# EasyEDA schematic rs485.json
TITLE: RS485; REV: 1.0; Date: 2022-08-19; Sheet: 1/1
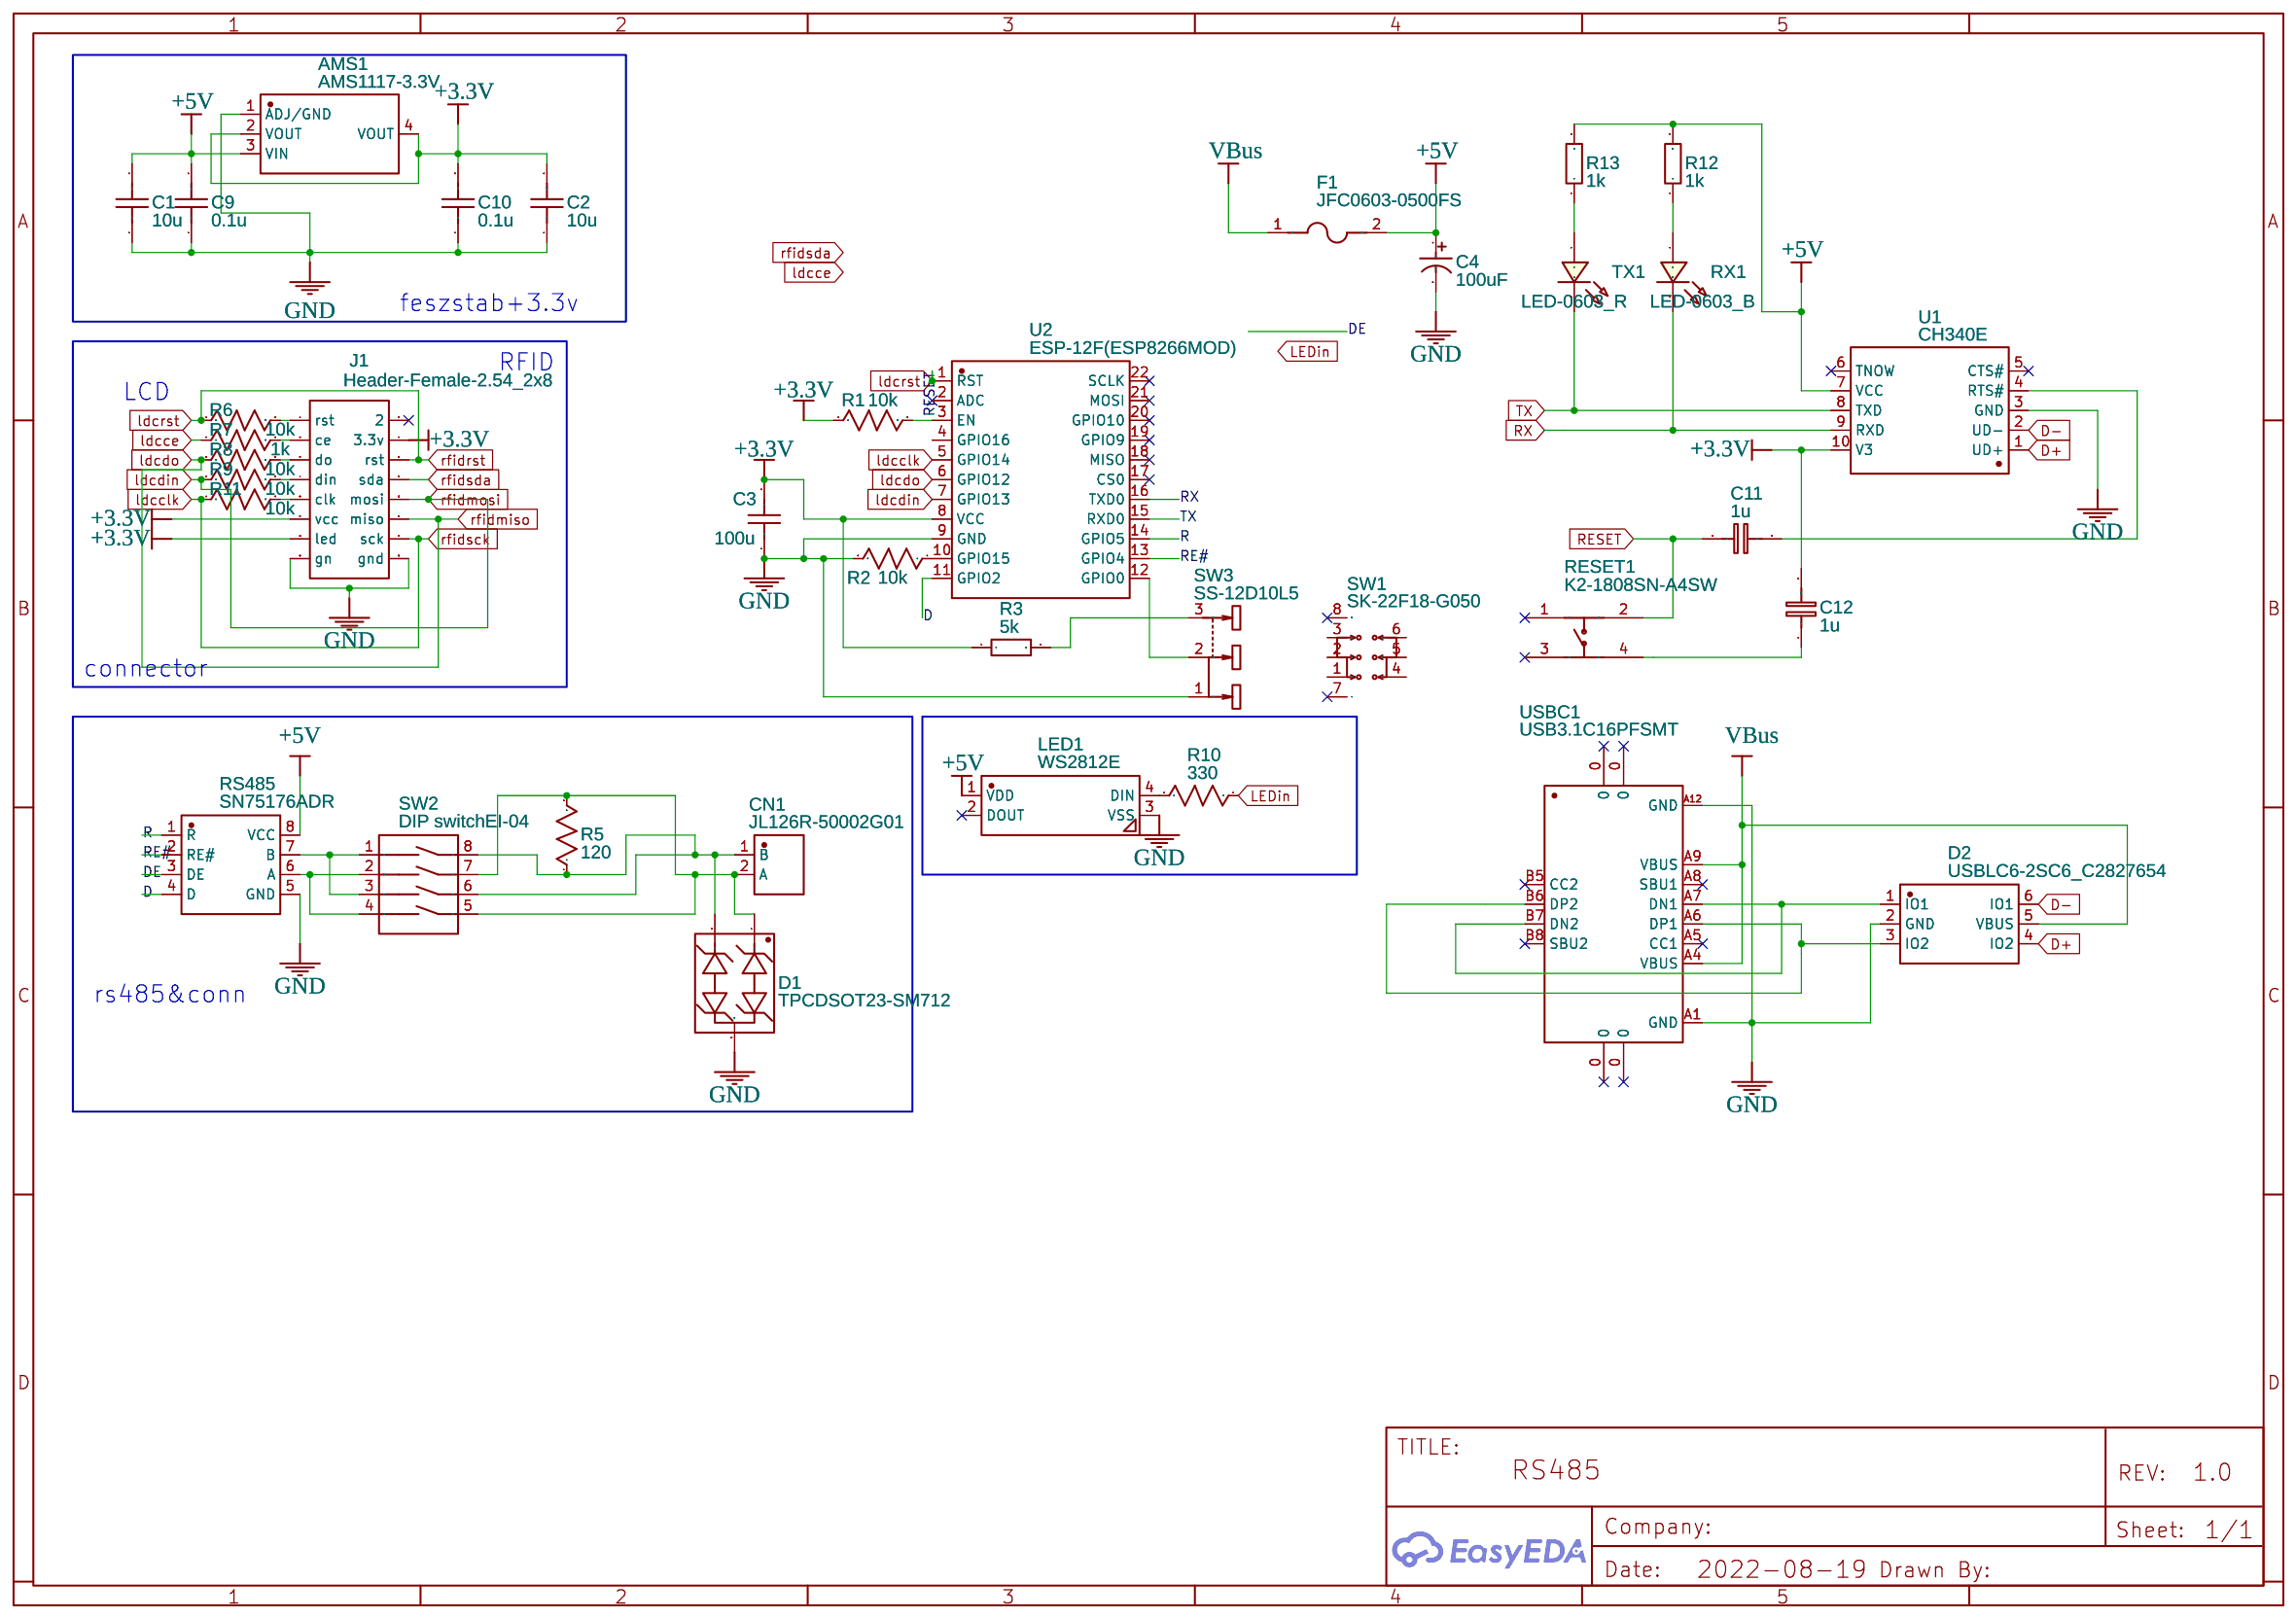
[diagram p0: schematic sheet]

## Parts
AMS1  AMS1117-3.3V  [SOT-223-4_L6.5-W3.5-P2.30-LS7.0-BR]
C1  10u  [C0603]
C2  10u  [C0603]
C3  100u  [C0603]
C4  100uF  [CAP-SMD_BD5.0-L5.3-W5.3-FD]
C9  0.1u  [C0603]
C10  0.1u  [C0603]
C11  1u  [0603]
C12  1u  [0603]
CN1  JL126R-50002G01  [CONN-TH_2P-P5.00_JL126R]
D1  TPCDSOT23-SM712  [SOT-23-3_L2.9-W1.6-P1.90-LS2.8-BR]
D2  USBLC6-2SC6_C2827654  [SOT-23-6_L2.9-W1.6-P0.95-LS2.8-BL]
F1  JFC0603-0500FS  [F0603]
J1  Header-Female-2.54_2x8  [HDR-TH_16P-P2.54-V-F-R2-C8-S2.54-1]
LED1  WS2812E  [LED-SMD_4P-L5.0-W5.0-BR]
R1  10k  [R0603]
R2  10k  [R0603]
R3  5k  [R0603]
R5  120  [R0603]
R6  10k  [R0603]
R7  1k  [R0603]
R8  10k  [R0603]
R9  10k  [R0603]
R10  330  [R0603]
R11  10k  [R0603]
R12  1k  [R0603]
R13  1k  [R0603]
RESET1  K2-1808SN-A4SW  [KEY-SMD_4P-L4.2-W3.2-P2.20-LS5.1-TL]
RS485  SN75176ADR  [SOIC-8_L4.9-W3.9-P1.27-LS6.0-BL]
RX1  LED-0603_B  [LED0603_BLUE]
SW1  SK-22F18-G050  [SW-TH_G-SWITCH_SK-22F18-G050]
SW2  DIP switchEI-04  [SW-TH_DIPSWITCHEI-04]
SW3  SS-12D10L5  [SW-TH_SS-12D10L5]
TX1  LED-0603_R  [LED0603_RED]
U1  CH340E  [MSOP-10_L3.0-W3.0-P0.50-LS5.0-BL]
U2  ESP-12F(ESP8266MOD)  [WIFIM-SMD_ESP-12F-ESP8266MOD]
USBC1  USB3.1C16PFSMT  [USB-C-SMD_TYPE-C-USB-17]

## Library data of the parts
AMS1 = AMS1117-3.3V: Supplier: LCSC; Supplier Part: C2688239; Manufacturer: WPMtek(维攀微); Contributor: LCSC; JLCPCB Part Class: Extended Part
C1-C3 C9 C10 = C_0603_US: Contributor: LCEDA_Lib
C4 = RVT1A101M0505-C3347: Supplier: LCSC; Manufacturer: HONOR; Manufacturer Part: RVT1A101M0505; Supplier Part: C3347
C11 C12 = Cap_0603_EU: Manufacturer Part: ?
CN1 = JL126R-50002G01: Supplier: LCSC; Supplier Part: C415452; Manufacturer: JILN; Contributor: LCSC; JLCPCB Part Class: Extended Part
D1 = TPCDSOT23-SM712: Supplier: LCSC; Supplier Part: C558433; Manufacturer: TECH PUBLIC; Contributor: LCSC; JLCPCB Part Class: Extended Part
D2 = USBLC6-2SC6_C2827654: Supplier: LCSC; Supplier Part: C2827654; Manufacturer: TECH PUBLIC(台舟); Manufacturer Part: USBLC6-2SC6; Contributor: LCSC; JLCPCB Part Class: Extended Part
F1 = JFC0603-0500FS: Supplier: LCSC; Manufacturer: JDTFUSE; Contributor: LCSC; Supplier Part: C136327
J1 = Header-Female-2.54_2x8: Supplier: LCSC; Manufacturer: BOOMELE; Manufacturer Part: 2.54mm,2×8Double female header; Supplier Part: C30734; JLCPCB Part Class: Extended Part
LED1 = WS2812E: Supplier: LCSC; Supplier Part: C139127; Manufacturer: Worldsemi; Contributor: LCSC; JLCPCB Part Class: Extended Part
R1 R2 R5-R11 = R_0603_US: Contributor: LCEDA_Lib
R3 R12 R13 = RS-03K102JT: Supplier: LCSC; Manufacturer: FH; Supplier Part: C73797
RESET1 = K2-1808SN-A4SW: Supplier: LCSC; Manufacturer: HRO; Supplier Part: C92589
RS485 = SN75176ADR: Supplier: LCSC; Supplier Part: C468242; Manufacturer: Texas Instruments; Contributor: LCSC; JLCPCB Part Class: Extended Part
RX1 = LED-0603_B: Manufacturer: EVERLIGHT(台湾亿光); Manufacturer Part: 19-217/BHC-ZL1M2RY/3T; Supplier Part: C72041; Supplier: LCSC; Contributor: LCEDA_01
SW1 = SK-22F18-G050: Supplier: LCSC; Supplier Part: C2848886; Manufacturer: G-Switch(品赞); Contributor: LCSC; JLCPCB Part Class: Extended Part
SW2 = DIP switchEI-04: Supplier: LCSC; Manufacturer: DIP; Supplier Part: C99987; JLCPCB Part Class: Extended Part
SW3 = SS-12D10L5: Supplier: LCSC; Supplier Part: C319012; Manufacturer: XKB Enterprise; Contributor: LCSC; JLCPCB Part Class: Extended Part
TX1 = LED-0603_R: Manufacturer: EVERLIGHT(台湾亿光); Manufacturer Part: 19-217/R6C-AL1M2VY/3T; Supplier Part: C72044; Supplier: LCSC; Contributor: LCEDA_01
U1 = CH340E: Supplier: LCSC; Manufacturer: WCH; Supplier Part: C99652; JLCPCB Part Class: Extended Part
U2 = ESP-12F(ESP8266MOD): Supplier: LCSC; Manufacturer: Ai-Thinker; Supplier Part: C82891; JLCPCB Part Class: Extended Part
USBC1 = USB3.1C16PFSMT: Supplier: LCSC; Supplier Part: C167321; Manufacturer: LCSC; Contributor: LCSC; JLCPCB Part Class: Extended Part

## Nets
+3.3V: AMS1.2(VOUT) AMS1.4(VOUT) C2.2 C3.2 C10.2 C12.2 J1.4(3.3v) J1.11(vcc) J1.13(led) R1.1 R3.1 U1.10(V3) U2.8(VCC)
+5V: AMS1.3(VIN) C1.2 C4.1 C9.2 F1.2 LED1.1(VDD) R12.2 R13.2 RS485.8(VCC) U1.7(VCC)
GND: AMS1.1(ADJ/GND) C1.1 C2.1 C3.1 C4.2 C9.1 C10.1 D1.3 D2.2(GND) J1.15(gn) J1.16(gnd) LED1.3(VSS) R2.2 RS485.5(GND) SW3.1 U1.3(GND) U2.9(GND) USBC1.A1(GND) USBC1.A12(GND)
VBus: D2.5(VBUS) F1.1 USBC1.A4(VBUS) USBC1.A9(VBUS)
D: RS485.4(D) U2.11(GPIO2)
D+: D2.4(IO2) U1.1(UD+)
D-: D2.6(IO1) U1.2(UD-)
DE: RS485.3(DE)
ldcce: R7.1
ldcclk: J1.14(sck) R11.1 U2.5(GPIO14)
ldcdin: J1.10(mosi) R9.1 U2.7(GPIO13)
ldcdo: J1.12(miso) R8.1 U2.6(GPIO12)
LEDin: R10.2
R: RS485.1(R) U2.14(GPIO5)
RE#: RS485.2(RE#) U2.13(GPIO4)
RESET: C11.1 J1.6(rst) R6.1 RESET1.2 U2.1(RST)
rfidsda: J1.8(sda)
RX: RX1.2 U1.9(RXD) U2.16(TXD0)
TX: TX1.2 U1.8(TXD) U2.15(RXD0)
Net-(C11-2): C11.2 U1.4(RTS#)
Net-(C12-1): C12.1 RESET1.4
Net-(CN1-1): CN1.1(B) D1.2 R5.1 SW2.6 SW2.8
Net-(CN1-2): CN1.2(A) D1.1 R5.2 SW2.5 SW2.7
Net-(D2-1): D2.1(IO1) USBC1.A7(DN1) USBC1.B7(DN2)
Net-(D2-3): D2.3(IO2) USBC1.A6(DP1) USBC1.B6(DP2)
Net-(J1-1): J1.1(rst) R6.2
Net-(J1-3): J1.3(ce) R7.2
Net-(J1-5): J1.5(do) R8.2
Net-(J1-7): J1.7(din) R9.2
Net-(J1-9): J1.9(clk) R11.2
Net-(LED1-4): LED1.4(DIN) R10.1
Net-(R1-2): R1.2 U2.3(EN)
Net-(R2-1): R2.1 U2.10(GPIO15)
Net-(R3-2): R3.2 SW3.3
Net-(R12-1): R12.1 RX1.1
Net-(R13-1): R13.1 TX1.1
Net-(RS485-6): RS485.6(A) SW2.2 SW2.4
Net-(RS485-7): RS485.7(B) SW2.1 SW2.3
Net-(SW3-2): SW3.2 U2.12(GPIO0)

Not connected (* = marked no-connect by the designer): J1 2*; LED1 2(DOUT)*; RESET1 1* 3*; SW1 1 2 3 4 5 6 7* 8*; U1 5(CTS#)* 6(TNOW)*; U2 2(ADC)* 4(GPIO16) 17(CS0)* 18(MISO)* 19(GPIO9)* 20(GPIO10)* 21(MOSI)* 22(SCLK)*; USBC1 0* A5(CC1)* A8(SBU1)* B5(CC2)* B8(SBU2)*

## Notes on the sheet
- feszstab+3.3v
- RFID
- LCD
- connector
- rs485&conn
